# EAGLE schematic watCals_schmatic (EAGLE 9.6.2)

## Sheet 1 of 5
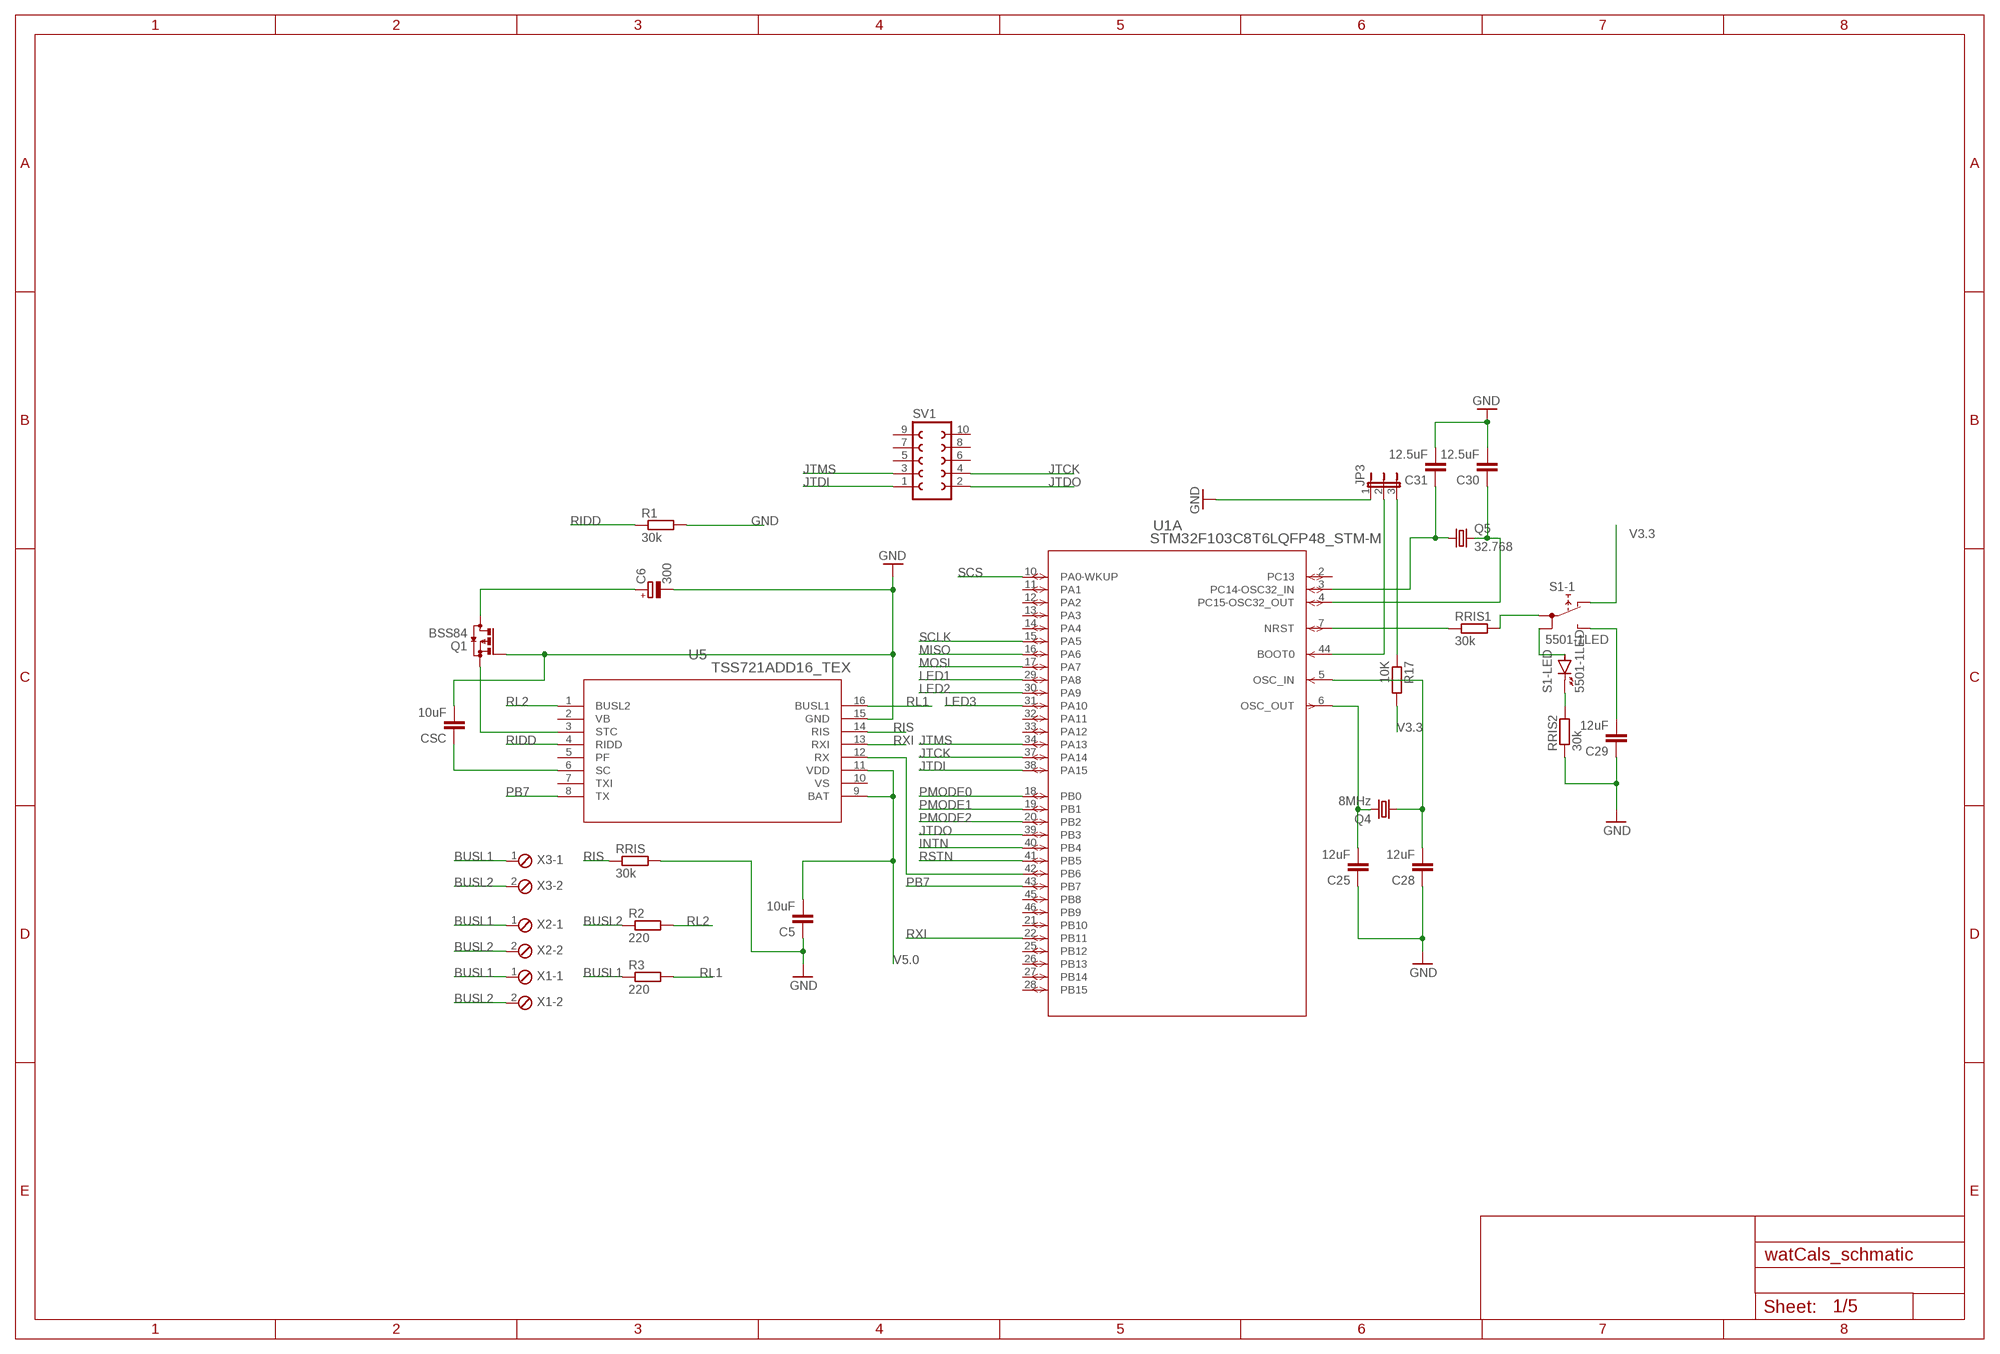
[diagram p0: schematic, sheet 1]

### Parts
C5  10uF  C2.5/2  [C2.5-2]
C6  300  CPOL-EUE2,5-6E  [E2,5-6E]
C25  12uF  C2.5/2  [C2.5-2]
C28  12uF  C2.5/2  [C2.5-2]
C29  12uF  C2.5/2  [C2.5-2]
C30  12.5uF  C2.5/2  [C2.5-2]
C31  12.5uF  C2.5/2  [C2.5-2]
CSC  10uF  C2.5/2  [C2.5-2]
JP3  JP2E  [JP2]
Q1  BSS84  [SOT23]
Q4  8MHz  CRYSTALHC49S  [HC49/S]
Q5  32.768  FC-12M  [FC-12M]
R1  30k  R-EU_0207/10  [0207/10]
R2  220  R-EU_0207/10  [0207/10]
R3  220  R-EU_0207/10  [0207/10]
R17  10K  R-EU_0207/10  [0207/10]
RRIS  30k  R-EU_0207/10  [0207/10]
RRIS1  30k  R-EU_0207/10  [0207/10]
RRIS2  30k  R-EU_0207/10  [0207/10]
S1  5501-1LED  [5501-1LED]
SV1  FE05-2  [FE05-2]
U1  STM32F103C8T6LQFP48_STM-M  [LQFP48_STM-M]
U5  TSS721ADD16_TEX  [D16_TEX]
X1  MPT2  [2POL254]
X2  MPT2  [2POL254]
X3  MPT2  [2POL254]

### Nets
BUSL1: R3.1 X1.1 X2.1 X3.1
BUSL2: R2.1 X1.2 X2.2 X3.2
GND: C5.1 C6.- C25.1 C28.1 C29.1 C30.2 C31.2 CSC.2 JP3.1 Q1.1(G) R1.2 RRIS2.1 RRIS.2 U5.15(GND) ; also sheet 2,3,4,5
INTN: U1.40(A:PB4) ; also sheet 4
JTCK: SV1.4 U1.37(A:PA14)
JTDI: SV1.1 U1.38(A:PA15)
JTDO: SV1.2 U1.39(A:PB3)
JTMS: SV1.3 U1.34(A:PA13)
LED1: U1.29(A:PA8) ; also sheet 2
LED2: U1.30(A:PA9) ; also sheet 2
LED3: U1.31(A:PA10) ; also sheet 2
MISO: U1.16(A:PA6) ; also sheet 4
MOSI: U1.17(A:PA7) ; also sheet 4
N$2: U1.42(A:PB6) U5.12(RX)
N$3: CSC.1 U5.6(SC)
N$4: Q1.2(S) U5.3(STC)
N$5: C6.+ Q1.3(D)
N$20: JP3.2 U1.44(A:BOOT0)
N$24: C25.2 Q4.2 U1.6(A:OSC_OUT)
N$26: JP3.3 R17.1
N$27: C28.2 Q4.1 U1.5(A:OSC_IN)
N$28: C29.2 S1.NO(-1:NO)
N$29: RRIS1.2 S1.1A(-1:1A)
N$30: RRIS1.1 U1.7(A:NRST)
N$31: C31.1 Q5.1 U1.3(A:PC14-OSC32_IN)
N$32: C30.1 Q5.2 U1.4(A:PC15-OSC32_OUT)
N$39: S1.1B(-1:1B) S1.+(-LED:A)
N$40: RRIS2.2 S1.-(-LED:K)
PB7: U1.43(A:PB7) U5.8(TX)
PMODE0: U1.18(A:PB0) ; also sheet 4
PMODE1: U1.19(A:PB1) ; also sheet 4
PMODE2: U1.20(A:PB2) ; also sheet 4
RIDD: R1.1 U5.4(RIDD)
RIS: RRIS.1 U5.14(RIS)
RL1: R3.2 U5.16(BUSL1)
RL2: R2.2 U5.1(BUSL2)
RSTN: U1.41(A:PB5) ; also sheet 4
RXI: U1.22(A:PB11) U5.13(RXI)
SCLK: U1.15(A:PA5) ; also sheet 4
SCS: U1.10(A:PA0-WKUP) ; also sheet 4
V3.3: R17.2 S1.NC(-1:NC) ; also sheet 2,3,4
V5.0: C5.2 U5.9(BAT) U5.11(VDD) ; also sheet 3
Unconnected: SV1.5 SV1.6 SV1.7 SV1.8 SV1.9 SV1.10 U1.2(A:PC13) U1.11(A:PA1) U1.12(A:PA2) U1.13(A:PA3) U1.14(A:PA4) U1.21(A:PB10) U1.25(A:PB12) U1.26(A:PB13) U1.27(A:PB14) U1.28(A:PB15) U1.32(A:PA11) U1.33(A:PA12) U1.45(A:PB8) U1.46(A:PB9) U5.2(VB) U5.5(PF) U5.7(TXI) U5.10(VS)

## Sheet 2 of 5
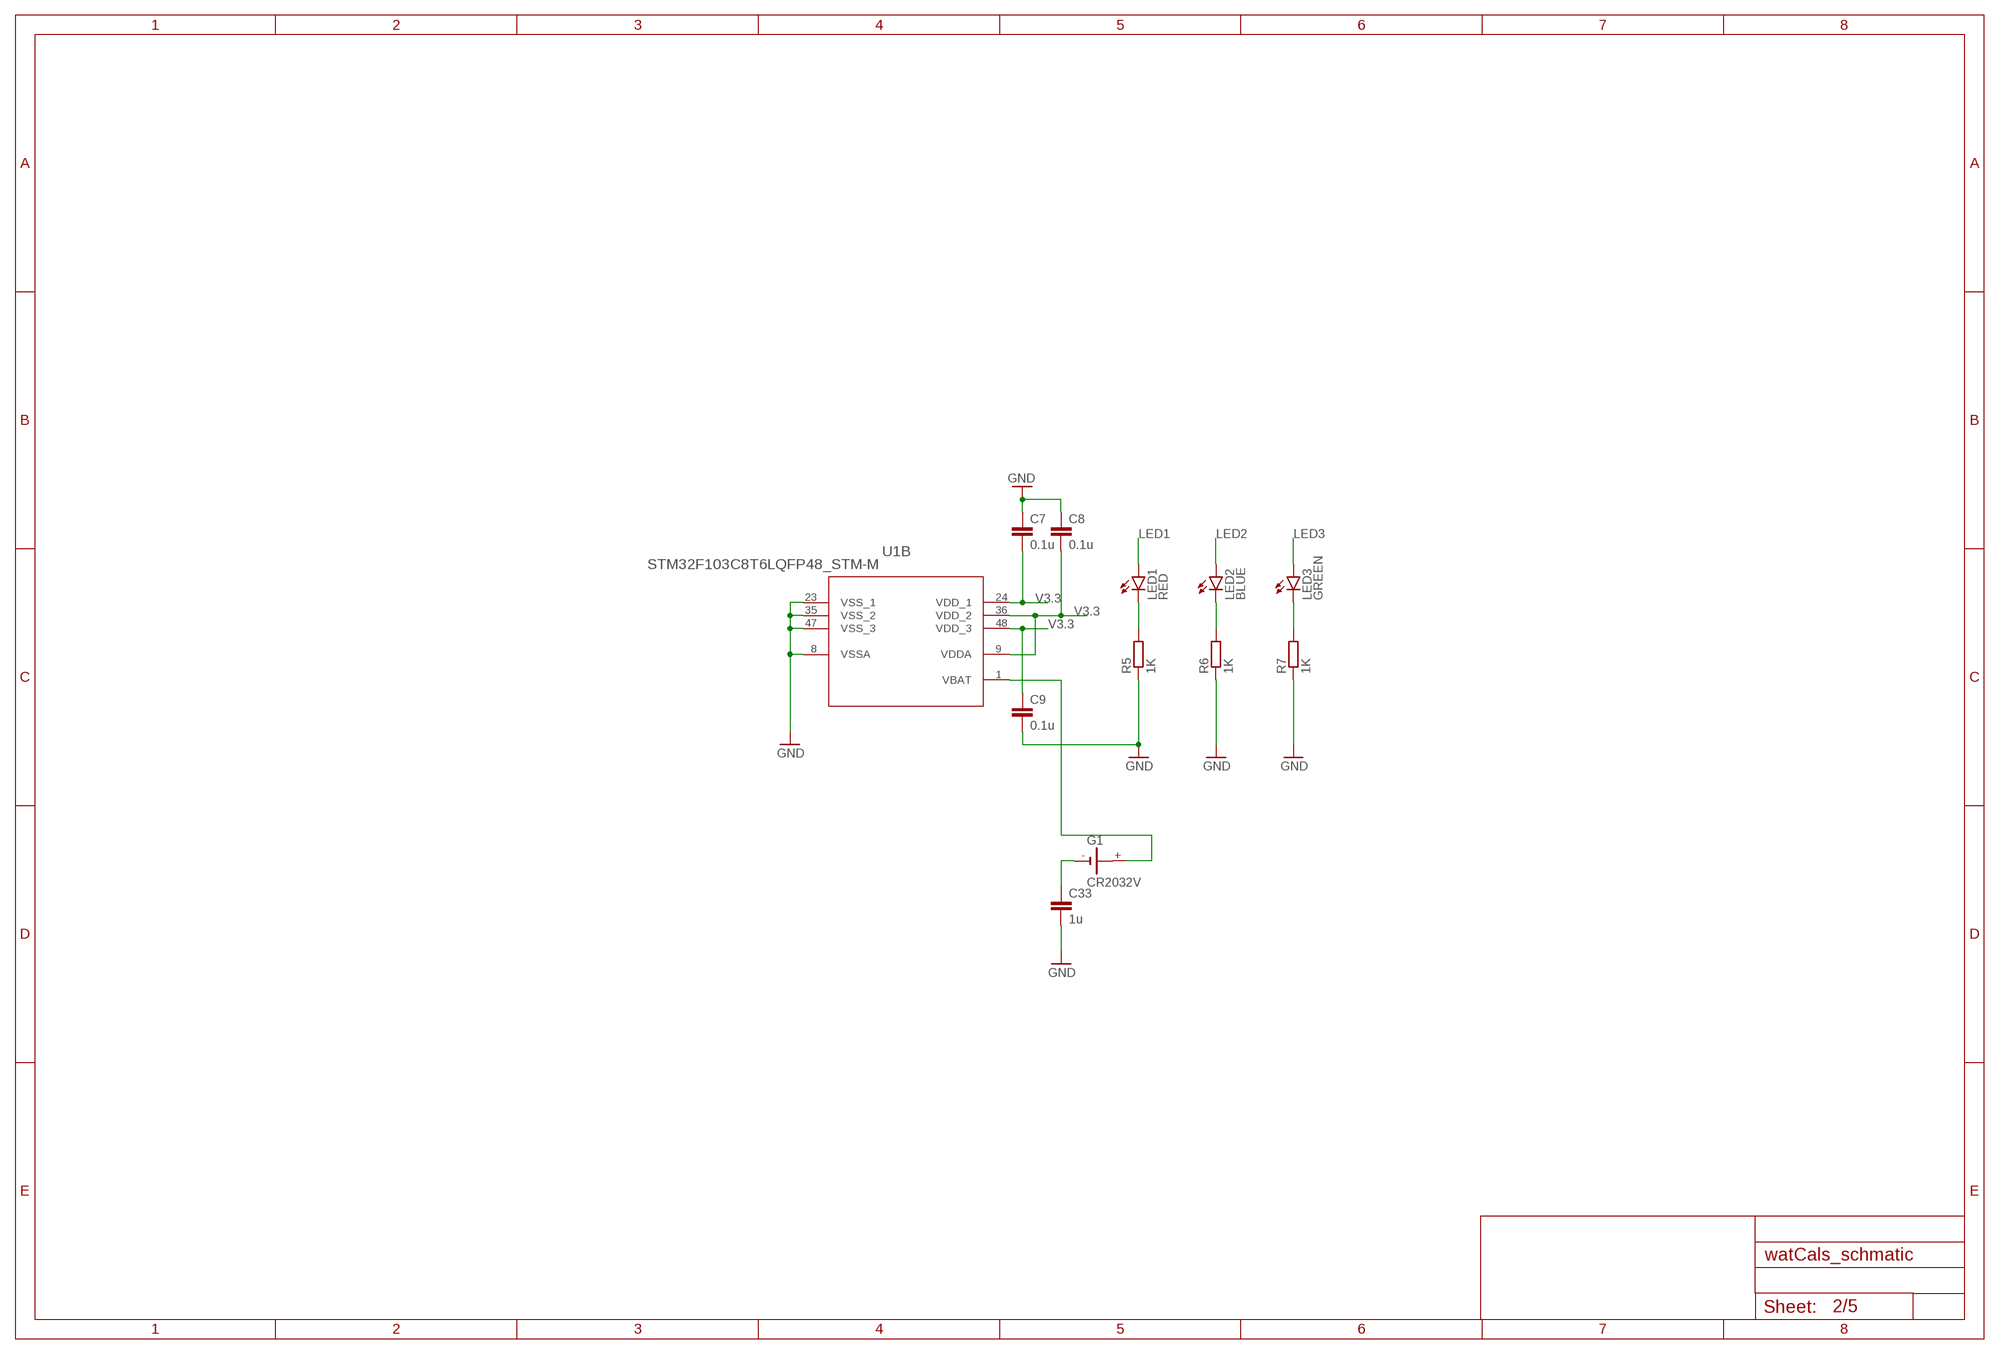
[diagram p1: schematic, sheet 2]

### Parts
C7  0.1u  C2.5/2  [C2.5-2]
C8  0.1u  C2.5/2  [C2.5-2]
C9  0.1u  C2.5/2  [C2.5-2]
C33  1u  C2.5/2  [C2.5-2]
G1  CR2032V  [CR2032V]
LED1  RED  LED5MM  [LED5MM]
LED2  BLUE  LED5MM  [LED5MM]
LED3  GREEN  LED5MM  [LED5MM]
R5  1K  R-EU_0207/10  [0207/10]
R6  1K  R-EU_0207/10  [0207/10]
R7  1K  R-EU_0207/10  [0207/10]

### Nets
GND: C7.1 C8.1 C9.2 C33.2 R5.1 R6.1 R7.1 U1.8(B:VSSA) U1.23(B:VSS_1) U1.35(B:VSS_2) U1.47(B:VSS_3) ; also sheet 1,3,4,5
LED1: LED1.A ; also sheet 1
LED2: LED2.A ; also sheet 1
LED3: LED3.A ; also sheet 1
N$6: LED1.K(C) R5.2
N$7: LED2.K(C) R6.2
N$8: LED3.K(C) R7.2
N$33: G1.+ U1.1(B:VBAT)
N$34: C33.1 G1.-
V3.3: C7.2 C8.2 C9.1 U1.9(B:VDDA) U1.24(B:VDD_1) U1.36(B:VDD_2) U1.48(B:VDD_3) ; also sheet 1,3,4
Unconnected: G1.+@1(+)

## Sheet 3 of 5
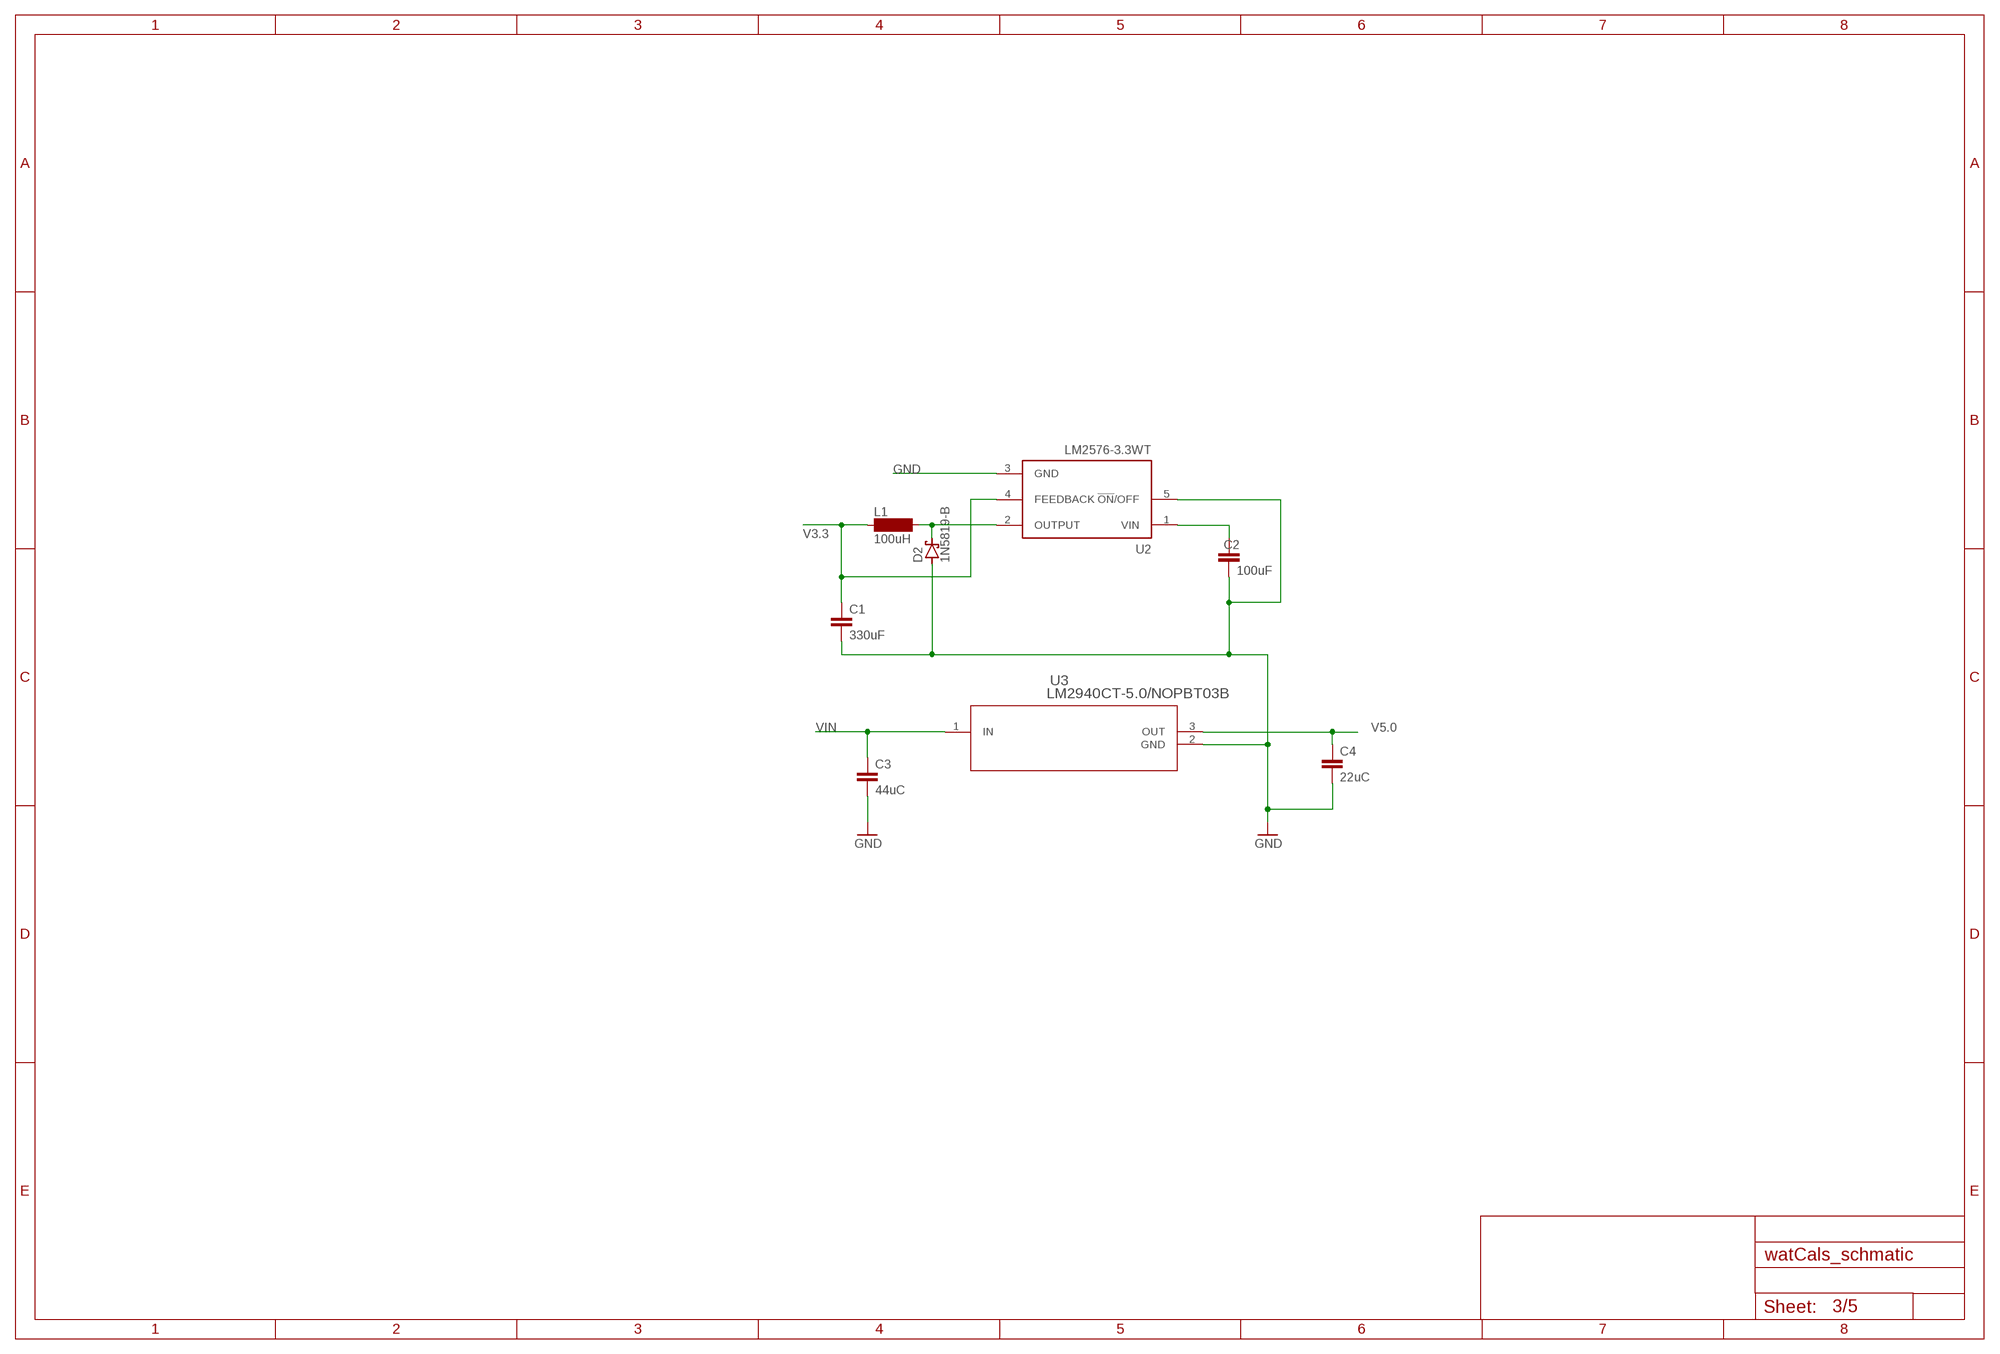
[diagram p2: schematic, sheet 3]

### Parts
C1  330uF  C2.5/2  [C2.5-2]
C2  100uF  C2.5/2  [C2.5-2]
C3  44uC  C2,5-3  [C2.5-3]
C4  22uC  C2,5-3  [C2.5-3]
D2  1N5819-B  [DO41-7.6]
L1  100uH  SD8  [SD8]
U2  LM2576-3.3WT  [TO170P1054X470X1514-5]
U3  LM2940CT-5.0/NOPBT03B  [T03B]

### Nets
GND: C1.2 C2.2 C3.2 C4.2 D2.A U2.3(GND) U2.5(!ON!/OFF) U3.2(GND) ; also sheet 1,2,4,5
N$1: D2.C L1.2 U2.2(OUTPUT)
N$35: C2.1 U2.1(VIN)
V3.3: C1.1 L1.1 U2.4(FEEDBACK) ; also sheet 1,2,4
V5.0: C4.1 U3.3(OUT) ; also sheet 1
VIN: C3.1 U3.1(IN) ; also sheet 5

## Sheet 4 of 5
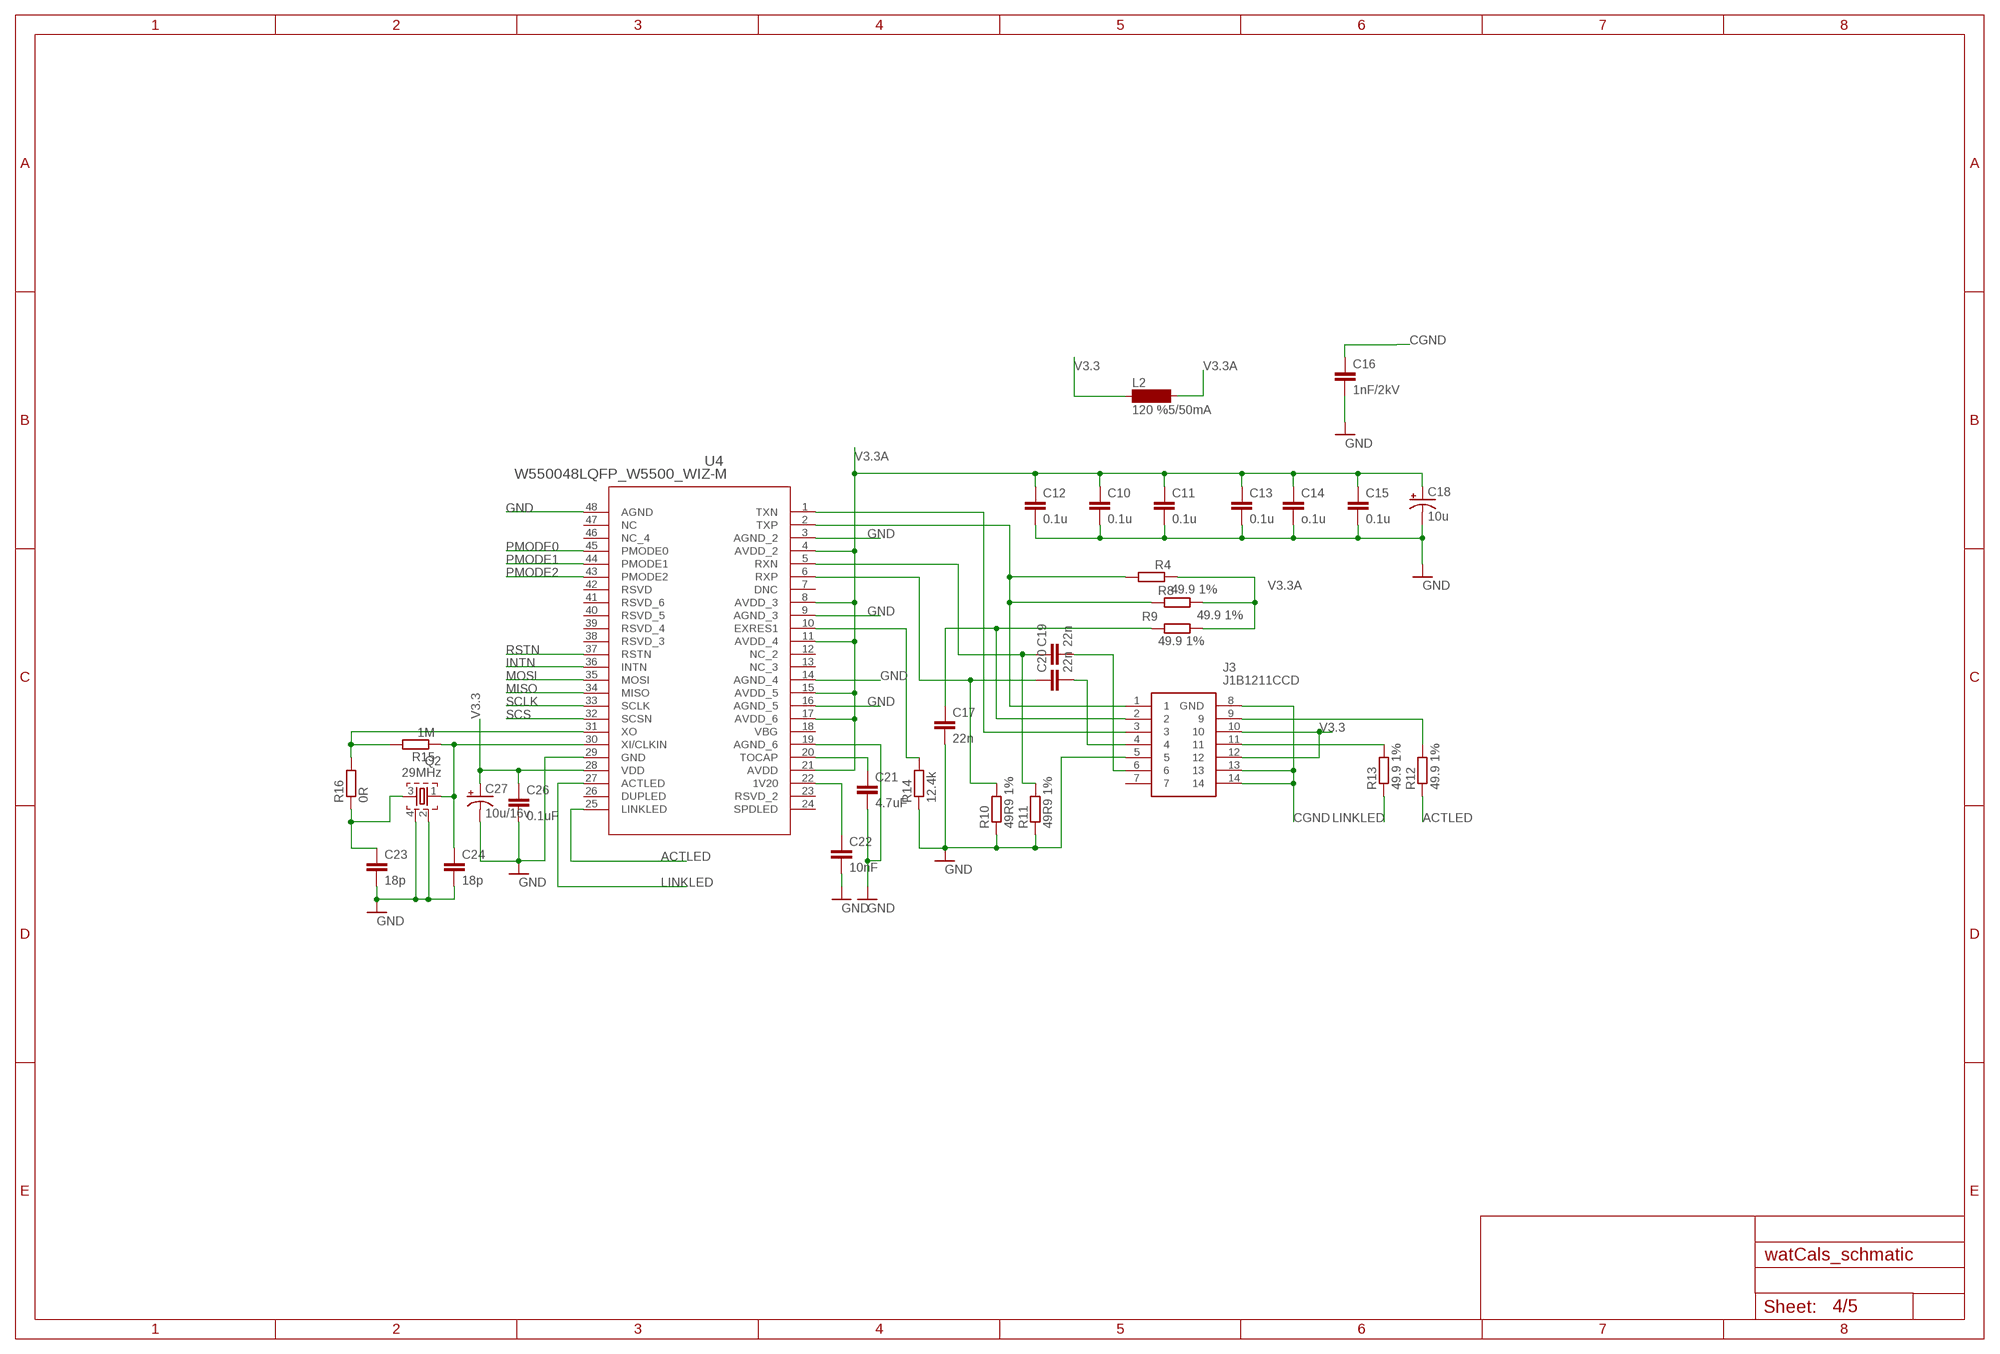
[diagram p3: schematic, sheet 4]

### Parts
C10  0.1u  C2.5/2  [C2.5-2]
C11  0.1u  C2.5/2  [C2.5-2]
C12  0.1u  C2.5/2  [C2.5-2]
C13  0.1u  C2.5/2  [C2.5-2]
C14  o.1u  C2.5/2  [C2.5-2]
C15  0.1u  C2.5/2  [C2.5-2]
C16  1nF/2kV  C2.5/2  [C2.5-2]
C17  22n  C2.5/2  [C2.5-2]
C18  10u  CPOL-USE2.5-6  [E2,5-6]
C19  22n  C2.5/2  [C2.5-2]
C20  22n  C2.5/2  [C2.5-2]
C21  4.7uF  C2.5/2  [C2.5-2]
C22  10nF  C2.5/2  [C2.5-2]
C23  18p  C2.5/2  [C2.5-2]
C24  18p  C2.5/2  [C2.5-2]
C26  0.1uF  C2.5/2  [C2.5-2]
C27  10u/16v  CPOL-USE2.5-6  [E2,5-6]
J3  J1B1211CCD  [J1B1211CCD]
L2  120 %5/50mA  SD8  [SD8]
Q2  29MHz  FA-20H  [FA-20H]
R4  49.9 1%  R-EU_0207/10  [0207/10]
R8  49.9 1%  R-EU_0207/10  [0207/10]
R9  49.9 1%  R-EU_0207/10  [0207/10]
R10  49R9 1%  R-EU_0207/10  [0207/10]
R11  49R9 1%  R-EU_0207/10  [0207/10]
R12  49.9 1%  R-EU_0207/10  [0207/10]
R13  49.9 1%  R-EU_0207/10  [0207/10]
R14  12.4k  R-EU_0207/10  [0207/10]
R15  1M  R-EU_0207/10  [0207/10]
R16  0R  R-EU_0207/10  [0207/10]
U4  W550048LQFP_W5500_WIZ-M  [48LQFP_W5500_WIZ-M]

### Nets
ACTLED: R12.1 U4.25(LINKLED)
CGND: C16.1 J3.8(GND) J3.13 J3.14
GND: C10.2 C11.2 C12.2 C13.2 C14.2 C15.2 C16.2 C17.2 C18.- C21.2 C22.2 C23.2 C24.2 C26.2 C27.- J3.5 Q2.2 Q2.4 R10.1 R11.1 R14.1 U4.3(AGND_2) U4.9(AGND_3) U4.14(AGND_4) U4.16(AGND_5) U4.19(AGND_6) U4.29(GND) U4.48(AGND) ; also sheet 1,2,3,5
INTN: U4.36(INTN) ; also sheet 1
LINKLED: R13.1 U4.27(ACTLED)
MISO: U4.34(MISO) ; also sheet 1
MOSI: U4.35(MOSI) ; also sheet 1
N$9: J3.3 U4.1(TXN)
N$10: J3.1 R4.2 R8.1 U4.2(TXP)
N$11: C17.1 J3.2 R9.1
N$12: C19.1 R11.2 U4.5(RXN)
N$13: C21.1 U4.20(TOCAP)
N$14: C20.1 R10.2 U4.6(RXP)
N$15: C20.2 J3.4
N$16: C19.2 J3.6
N$17: J3.11 R13.2
N$18: J3.9 R12.2
N$19: C23.1 Q2.3 R16.1
N$21: R14.2 U4.10(EXRES1)
N$22: C24.1 Q2.1 R15.1 U4.30(XI/CLKIN)
N$23: C22.1 U4.22(1V20)
N$36: R15.2 R16.2 U4.31(XO)
PMODE0: U4.45(PMODE0) ; also sheet 1
PMODE1: U4.44(PMODE1) ; also sheet 1
PMODE2: U4.43(PMODE2) ; also sheet 1
RSTN: U4.37(RSTN) ; also sheet 1
SCLK: U4.33(SCLK) ; also sheet 1
SCS: U4.32(SCSN) ; also sheet 1
V3.3: C26.1 C27.+ J3.10 J3.12 L2.1 U4.28(VDD) ; also sheet 1,2,3
V3.3A: C10.1 C11.1 C12.1 C13.1 C14.1 C15.1 C18.+ L2.2 R4.1 R8.2 R9.2 U4.4(AVDD_2) U4.8(AVDD_3) U4.11(AVDD_4) U4.15(AVDD_5) U4.17(AVDD_6) U4.21(AVDD)
Unconnected: J3.7 U4.7(DNC) U4.12(NC_2) U4.13(NC_3) U4.18(VBG) U4.23(RSVD_2) U4.24(SPDLED) U4.26(DUPLED) U4.38(RSVD_3) U4.39(RSVD_4) U4.40(RSVD_5) U4.41(RSVD_6) U4.42(RSVD) U4.46(NC_4) U4.47(NC)

## Sheet 5 of 5
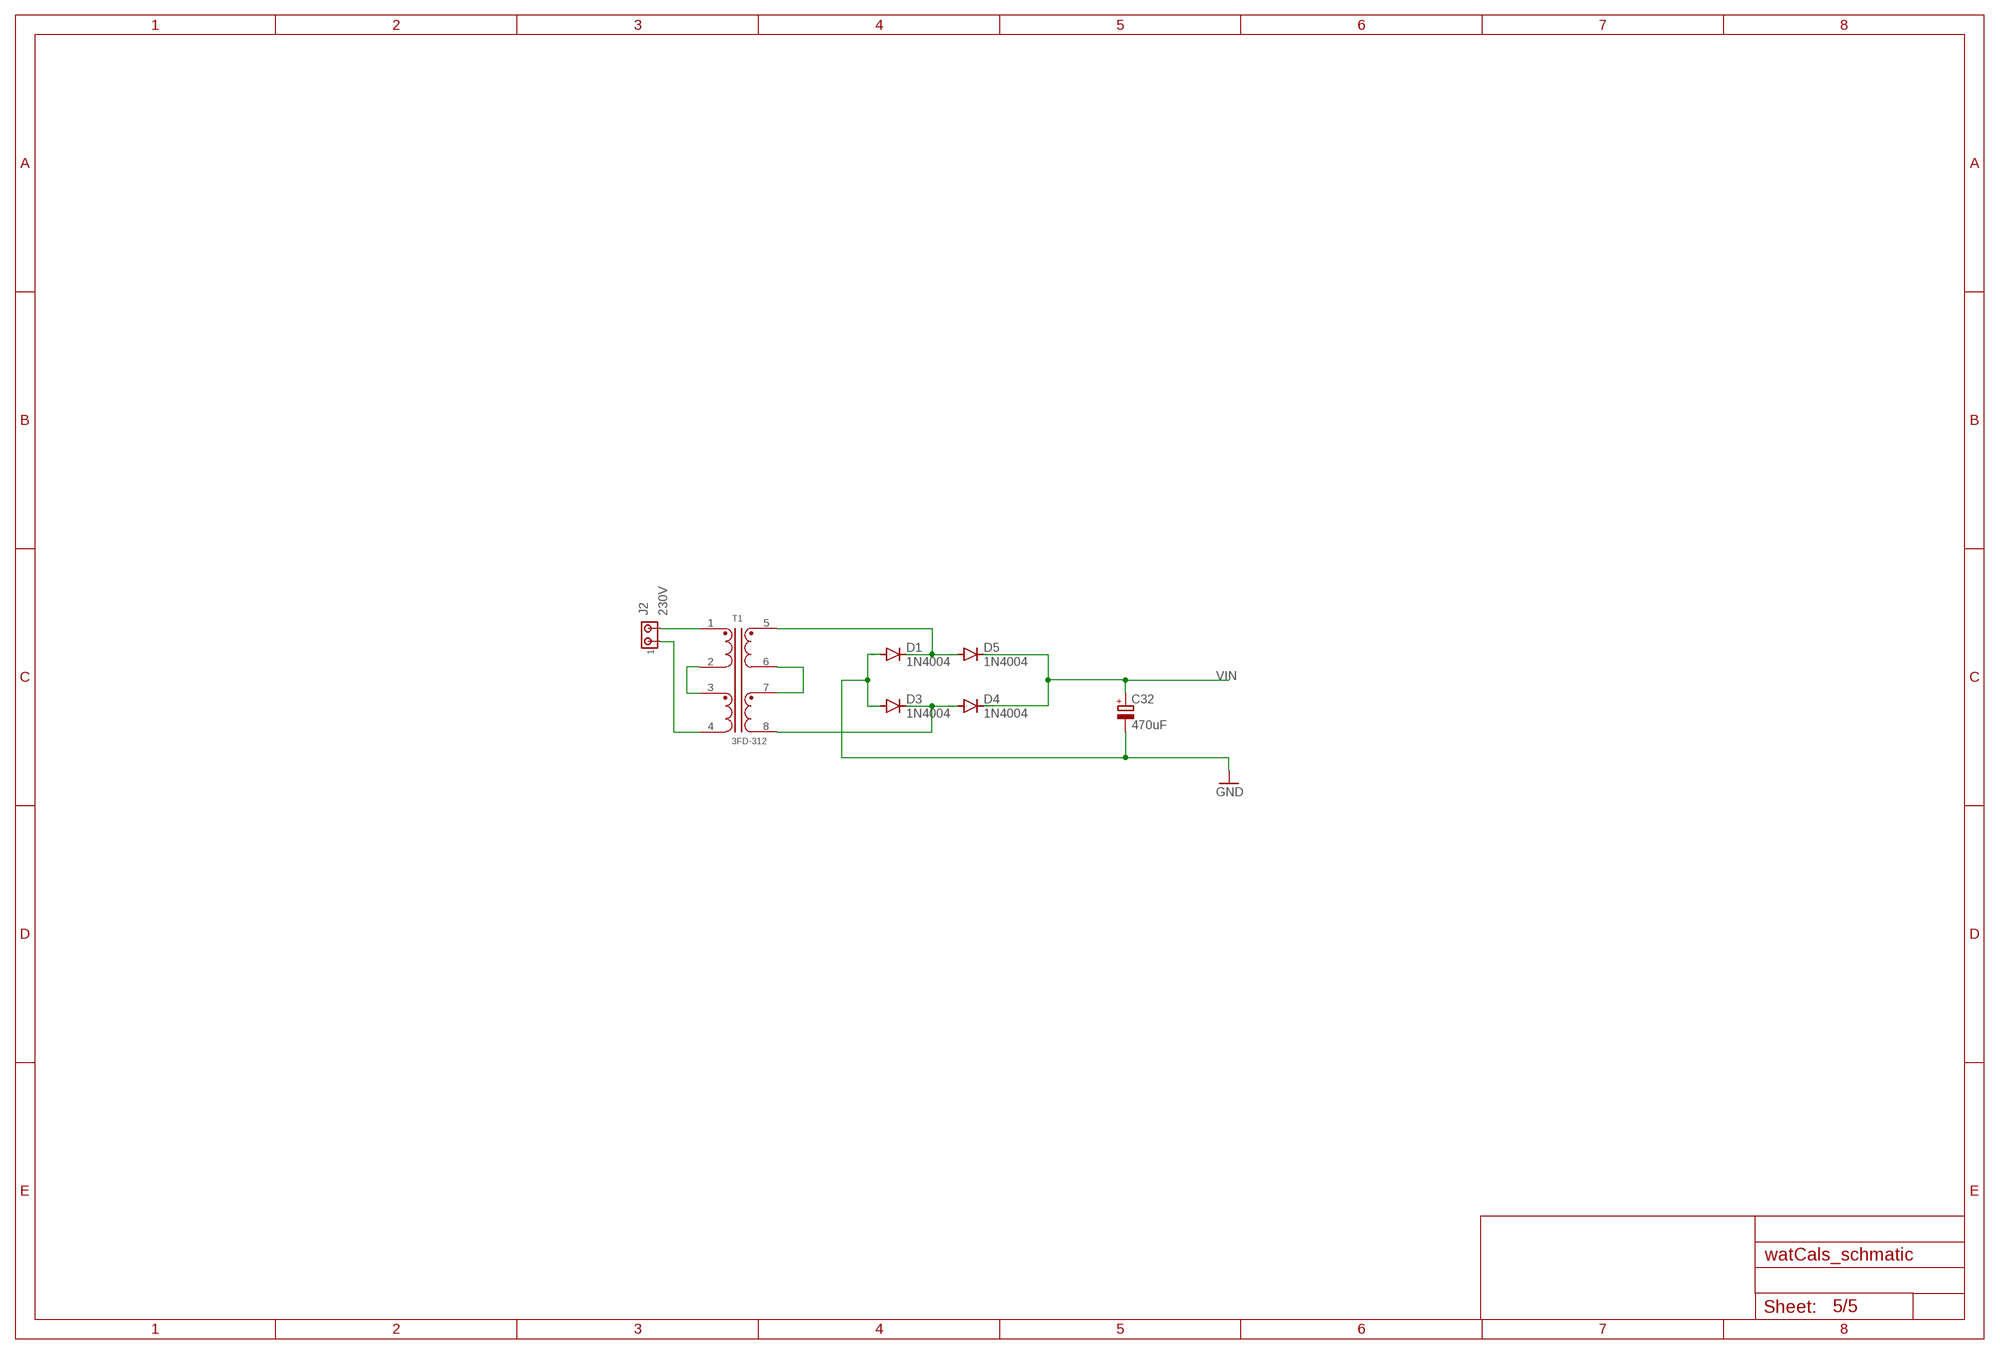
[diagram p4: schematic, sheet 5]

### Parts
C32  470uF  CPOL-EUE2,5-6E  [E2,5-6E]
D1  1N4004  [DO41-10]
D3  1N4004  [DO41-10]
D4  1N4004  [DO41-10]
D5  1N4004  [DO41-10]
J2  230V  MTA02-100  [10X02MTA]
T1  3FD-312  [XFMR_3FD-312]

### Nets
GND: C32.- D1.A D3.A ; also sheet 1,2,3,4
N$41: T1.6 T1.7
N$44: J2.2 T1.1
N$45: T1.2 T1.3
N$47: J2.1 T1.4
N$48: D1.C D5.A T1.5
N$51: D3.C D4.A T1.8
VIN: C32.+ D4.C D5.C ; also sheet 3

## Library data of the parts
C1-C5 C7-C17 C19-C26 C28-C31 C33 CSC = capacitor-wima:C: CAPACITOR naming: grid - package width
C6 C32 = rcl:CPOL-EU: POLARIZED CAPACITOR, European symbol; SPICEPREFIX: C
C18 C27 = rcl:CPOL-US: POLARIZED CAPACITOR, American symbol; SPICEPREFIX: C
D1 D3-D5 = diode:1N4004: DIODE general purpose rectifier, 1 A
D2 = diode:1N581*: 1.0A SCHOTTKY BARRIER RECTIFIER Source: http://www.diodes.com/datasheets/ds23001.pdf
G1 = battery:CR2032V: LI BATTERY Varta
J2 = con-amp:MTA02-100: AMP connector
J3 = J1B1211CCD:J1B1211CCD: Modules Accessories RJ-45 w/ Transformer Connector /CETUS Source: Datasheet <http://wizwiki.net/wiki/lib/exe/fetch.php?media=products:wiz550web:wiz550webds_kr:j1b1211ccd.pdf>; DESCRIPTION: Modules Accessories RJ-45 w/ Transformer Connector /CETUS; HEIGHT: mm; MANUFACTURER_NAME: WIZnet Inc; MANUFACTURER_PART_NUMBER: J1B1211CCD
JP3 = jumper:JP2E: JUMPER
L1 L2 = inductor-neosid:SD8: INDUCTOR nominal inductance; OC_FARNELL: unknown; OC_NEWARK: unknown
LED1-LED3 = led:LED: LED OSRAM: - CHIPLED LG R971, LG N971, LY N971, LG Q971, LY Q971, LO R971, LY R971 LH N974, LH R974 LS Q976, LO Q976, LY Q976 LO Q996 - Hyper CHIPLED LW Q18S LB Q993, LB Q99A, LB R99A - SideLED LS A670, LO A670, LY A670, LG A670, LP A670 LB A673, LV A673, LT A673, LW A673 LH A674 LY A675 LS A676, LA A676, LO A676, LY A676, LW A676 LS A679, LY A679, LG A679 - Hyper Micro SIDELED® LS Y876, LA Y876, LO Y876, LY Y876 LT Y87S - SmartLED LW L88C, LW L88S LB L89C, LB L89S, LG L890 LS L89K, LO L89K, LY L89K LS L896, LA L896, LO L896, LY L896 - TOPLED LS T670, LO T670, LY T670, LG T670, LP T670 LSG T670, LSP T670, LSY T670, LOP T670, LYG T670 LG T671, LOG T671, LSG T671 LB T673, LV T673, LT T673, LW T673 LH T674 LS T676, LA T676, LO T676, LY T676, LB T676, LH T676, LSB T676, LW T676 LB T67C, LV T67C, LT T67C, LS T67K, LO T67K, LY T67K, LW E67C LS E67B, LA E67B, LO E67B, LY E67B, LB E67C, LV E67C, LT E67C LW T67C LS T679, LY T679, LG T679 LS T770, LO T770, LY T770, LG T770, LP T770 LB T773, LV T773, LT T773, LW T773 LH T774 LS E675, LA E675, LY E675, LS T675 LS T776, LA T776, LO T776, LY T776, LB T776 LHGB T686 LT T68C, LB T68C - Hyper Mini TOPLED® LB M676 - Mini TOPLED Santana® LG M470 LS M47K, LO M47K, LY M47K Source: http://www.osram.convergy.de LUXEON: - LUMILED® LXK2-PW12-R00, LXK2-PW12-S00, LXK2-PW14-U00, LXK2-PW14-V00 LXK2-PM12-R00, LXK2-PM12-S00, LXK2-PM14-U00 LXK2-PE12-Q00, LXK2-PE12-R00, LXK2-PE12-S00, LXK2-PE14-T00, LXK2-PE14-U00 LXK2-PB12-K00, LXK2-PB12-L00, LXK2-PB12-M00, LXK2-PB14-N00, LXK2-PB14-P00, LXK2-PB14-Q00 LXK2-PR12-L00, LXK2-PR12-M00, LXK2-PR14-Q00, LXK2-PR14-R00 LXK2-PD12-Q00, LXK2-PD12-R00, LXK2-PD12-S00 LXK2-PH12-R00, LXK2-PH12-S00 LXK2-PL12-P00, LXK2-PL12-Q00, LXK2-PL12-R00 Source: www.luxeon.com KINGBRIGHT: KA-3528ASYC Source: www.kingbright.com
Q1 = transistor-small-signal:BSS84: P-CHANNEL MOS FET
Q2 = crystal:FA-: MHz RANGE CRYSTAL UNIT Source: Epson Toyocom
Q4 = crystal:CRYSTAL: CRYSTAL; OC_FARNELL: 1667008; OC_NEWARK: unknown
Q5 = crystal:FC-12M: kHz RANGE CRYSTAL UNIT LOW PROFILE SMD Source: Epson Toyocom FC-12M.pdf
R1-R17 RRIS RRIS1 RRIS2 = rcl:R-EU_: RESISTOR, European symbol; SPICEPREFIX: R
S1 = switch:55?-1LED: PUSHBUTTON SERIES 5500 SWITCHES 1 LED Source: www.e-switch.com .. 5500.pdf
SV1 = con-lsta:FE05-2: FEMALE HEADER; OC_FARNELL: unknown; OC_NEWARK: unknown
T1 = 3FD-312:3FD-312: Transformers 12.6VCT@.2A 6.3V@.4A Dual Primary Check availability <https://pricing.snapeda.com/parts/3FD-312/Tamura/view-part?ref=eda>; AVAILABILITY: In Stock; CHECK_PRICES: https://www.snapeda.com/parts/3FD-312/Tamura/view-part/?ref=eda; DESCRIPTION: PWR XFMR LAMINATED 2.4VA TH; MF: Tamura; MP: 3FD-312; PACKAGE: None; PRICE: None; PURCHASE-URL: https://www.snapeda.com/api/url_track_click_mouser/?unipart_id=283554&manufacturer=Tamura&part_name=3FD-312&search_term=tamura 3fd-312 (transformer); SNAPEDA_LINK: https://www.snapeda.com/parts/3FD-312/Tamura/view-part/?ref=snap
U1 = FYPmcu:STM32F103C8T6; COPYRIGHT: Copyright (C) 2024 Ultra Librarian. All rights reserved.; MANUFACTURER_PART_NUMBER: STM32F103C8T6; MFR_NAME: STMicroelectronics
U2 = LM2576-3.3WT:LM2576-3.3WT: Switching Voltage Regulators 3A Step-Down SMPS Regulator Check availability <https://pricing.snapeda.com/parts/LM2576-3.3WT/Microchip/view-part?ref=eda>; AVAILABILITY: In Stock; CHECK_PRICES: https://www.snapeda.com/parts/LM2576-3.3WT/Microchip/view-part/?ref=eda; DESCRIPTION: Buck Switching Regulator IC Positive Fixed 3.3V 1 Output 3A TO-220-5; MF: Microchip; MP: LM2576-3.3WT; PACKAGE: TO-220 Microchip; PRICE: None; PURCHASE-URL: https://www.snapeda.com/api/url_track_click_mouser/?unipart_id=681089&manufacturer=Microchip&part_name=LM2576-3.3WT&search_term=lm2576-3.3; SNAPEDA_LINK: https://www.snapeda.com/parts/LM2576-3.3WT/Microchip/view-part/?ref=snap
U3 = FYPrugu5:LM2940CT-5.0/NOPB; COPYRIGHT: Copyright (C) 2024 Ultra Librarian. All rights reserved.; MANUFACTURER_PART_NUMBER: LM2940CT-5.0/NOPB; MFR_NAME: Texas Instruments; TYPE: LM2940CT-12
U4 = FYP_W5500:W5500; COPYRIGHT: Copyright (C) 2024 Ultra Librarian. All rights reserved.; MANUFACTURER_PART_NUMBER: W5500; MFR_NAME: WIZnet
U5 = FYP_Trans:TSS721AD; COPYRIGHT: Copyright (C) 2024 Ultra Librarian. All rights reserved.; MANUFACTURER_PART_NUMBER: TSS721AD; MFR_NAME: Texas Instruments
X1-X3 = con-phoenix-254:MPT2: PHOENIX CONNECTOR; OC_FARNELL: unknown; OC_NEWARK: unknown